# EAGLE design IM920Receiver (EAGLE 9.1.3)
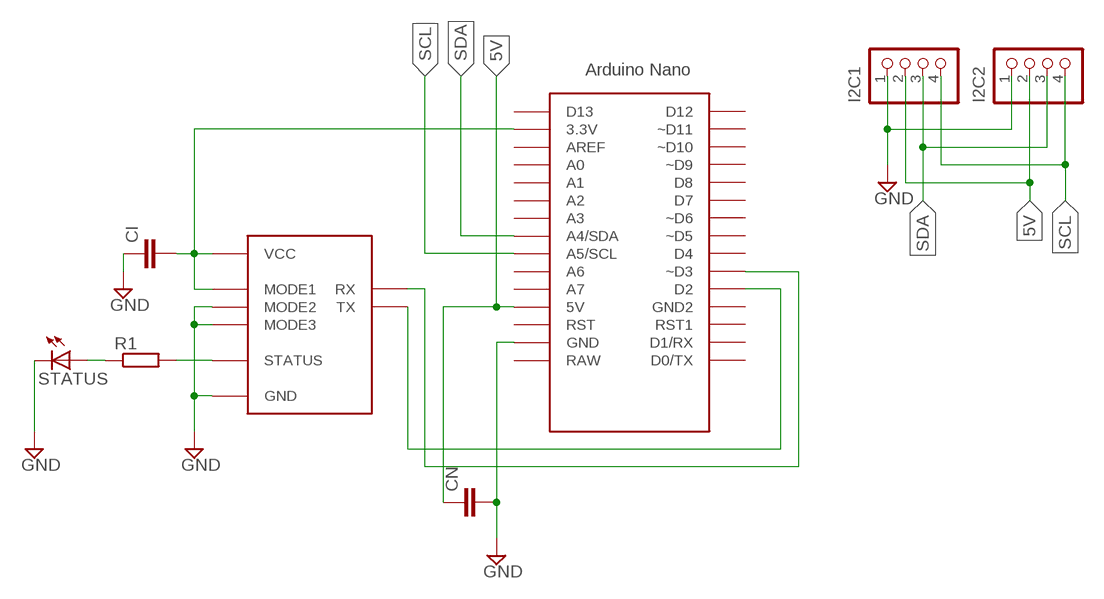
[diagram p0: schematic, sheet 1]

## Parts
CI  C2.5/2  [C2.5-2]
CN  C2.5/2  [C2.5-2]
I2C1  B4B-XH-A  [B4B-XH-A]
I2C2  B4B-XH-A  [B4B-XH-A]
R1  R-EU_0204/7  [0204/7]
STATUS  LED3MM  [LED3MM]
U$1  IM920  [IM920]
U$2  NANO  [NANO]

## Nets
5V: CN.1 I2C1.2 I2C2.2 U$2.5V
GND: CI.1 CN.2 I2C1.1 I2C2.1 STATUS.K(C) U$1.GND U$1.MODE2 U$1.MODE3 U$2.GND
N$1: U$1.TX U$2.D2
N$2: U$1.RX U$2.D3(~D3)
N$3: CI.2 U$1.MODE1 U$1.VCC U$2.3.3V
N$4: R1.2 U$1.STATUS
N$5: R1.1 STATUS.A
SCL: I2C1.4 I2C2.4 U$2.A5(A5/SCL)
SDA: I2C1.3 I2C2.3 U$2.A4(A4/SDA)
Unconnected: U$2.A0 U$2.A1 U$2.A2 U$2.A3 U$2.A6 U$2.A7 U$2.AREF U$2.D4 U$2.D5(~D5) U$2.D6(~D6) U$2.D7 U$2.D8 U$2.D9(~D9) U$2.D10(~D10) U$2.D11(~D11) U$2.D12 U$2.D13 U$2.GND1(GND2) U$2.RAW U$2.RST U$2.RST1 U$2.RX1(D1/RX) U$2.TX0(D0/TX)

## Library data of the parts
CI CN = capacitor-wima:C: CAPACITOR naming: grid - package width
I2C1 I2C2 = jst-xh:B4B-XH-A: Wire-to-Board 2.5mm pitch top mount connector Source: http://www.jst-mfg.com/product/pdf/jpn/XH.pdf http://www.jst-mfg.com/product/detail.php?series=277
R1 = rcl:R-EU_: RESISTOR, European symbol; SPICEPREFIX: R
STATUS = led:LED: LED OSRAM: - CHIPLED LG R971, LG N971, LY N971, LG Q971, LY Q971, LO R971, LY R971 LH N974, LH R974 LS Q976, LO Q976, LY Q976 LO Q996 - Hyper CHIPLED LW Q18S LB Q993, LB Q99A, LB R99A - SideLED LS A670, LO A670, LY A670, LG A670, LP A670 LB A673, LV A673, LT A673, LW A673 LH A674 LY A675 LS A676, LA A676, LO A676, LY A676, LW A676 LS A679, LY A679, LG A679 - Hyper Micro SIDELED® LS Y876, LA Y876, LO Y876, LY Y876 LT Y87S - SmartLED LW L88C, LW L88S LB L89C, LB L89S, LG L890 LS L89K, LO L89K, LY L89K LS L896, LA L896, LO L896, LY L896 - TOPLED LS T670, LO T670, LY T670, LG T670, LP T670 LSG T670, LSP T670, LSY T670, LOP T670, LYG T670 LG T671, LOG T671, LSG T671 LB T673, LV T673, LT T673, LW T673 LH T674 LS T676, LA T676, LO T676, LY T676, LB T676, LH T676, LSB T676, LW T676 LB T67C, LV T67C, LT T67C, LS T67K, LO T67K, LY T67K, LW E67C LS E67B, LA E67B, LO E67B, LY E67B, LB E67C, LV E67C, LT E67C LW T67C LS T679, LY T679, LG T679 LS T770, LO T770, LY T770, LG T770, LP T770 LB T773, LV T773, LT T773, LW T773 LH T774 LS E675, LA E675, LY E675, LS T675 LS T776, LA T776, LO T776, LY T776, LB T776 LHGB T686 LT T68C, LB T68C - Hyper Mini TOPLED® LB M676 - Mini TOPLED Santana® LG M470 LS M47K, LO M47K, LY M47K Source: http://www.osram.convergy.de LUXEON: - LUMILED® LXK2-PW12-R00, LXK2-PW12-S00, LXK2-PW14-U00, LXK2-PW14-V00 LXK2-PM12-R00, LXK2-PM12-S00, LXK2-PM14-U00 LXK2-PE12-Q00, LXK2-PE12-R00, LXK2-PE12-S00, LXK2-PE14-T00, LXK2-PE14-U00 LXK2-PB12-K00, LXK2-PB12-L00, LXK2-PB12-M00, LXK2-PB14-N00, LXK2-PB14-P00, LXK2-PB14-Q00 LXK2-PR12-L00, LXK2-PR12-M00, LXK2-PR14-Q00, LXK2-PR14-R00 LXK2-PD12-Q00, LXK2-PD12-R00, LXK2-PD12-S00 LXK2-PH12-R00, LXK2-PH12-S00 LXK2-PL12-P00, LXK2-PL12-Q00, LXK2-PL12-R00 Source: www.luxeon.com KINGBRIGHT: KA-3528ASYC Source: www.kingbright.com
U$1 = im920:IM920
U$2 = Arduino-clone:NANO: Arduino Nano

## Board
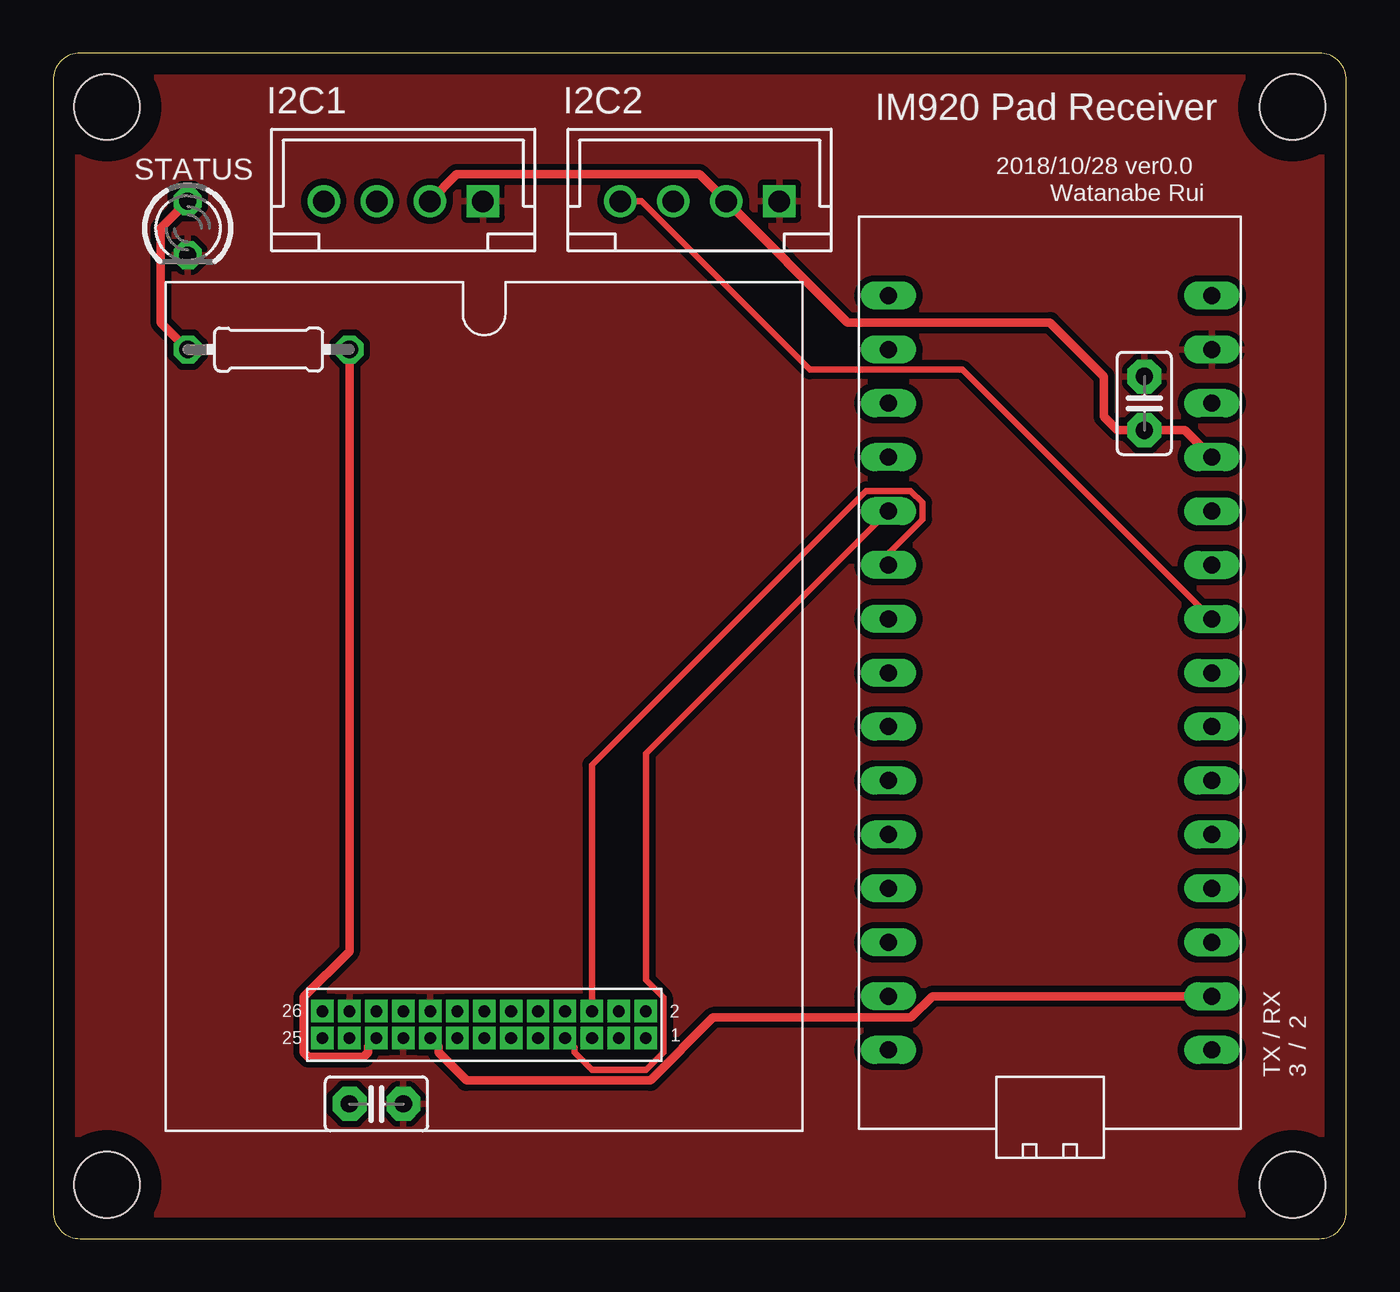
[diagram p1: board, top side]
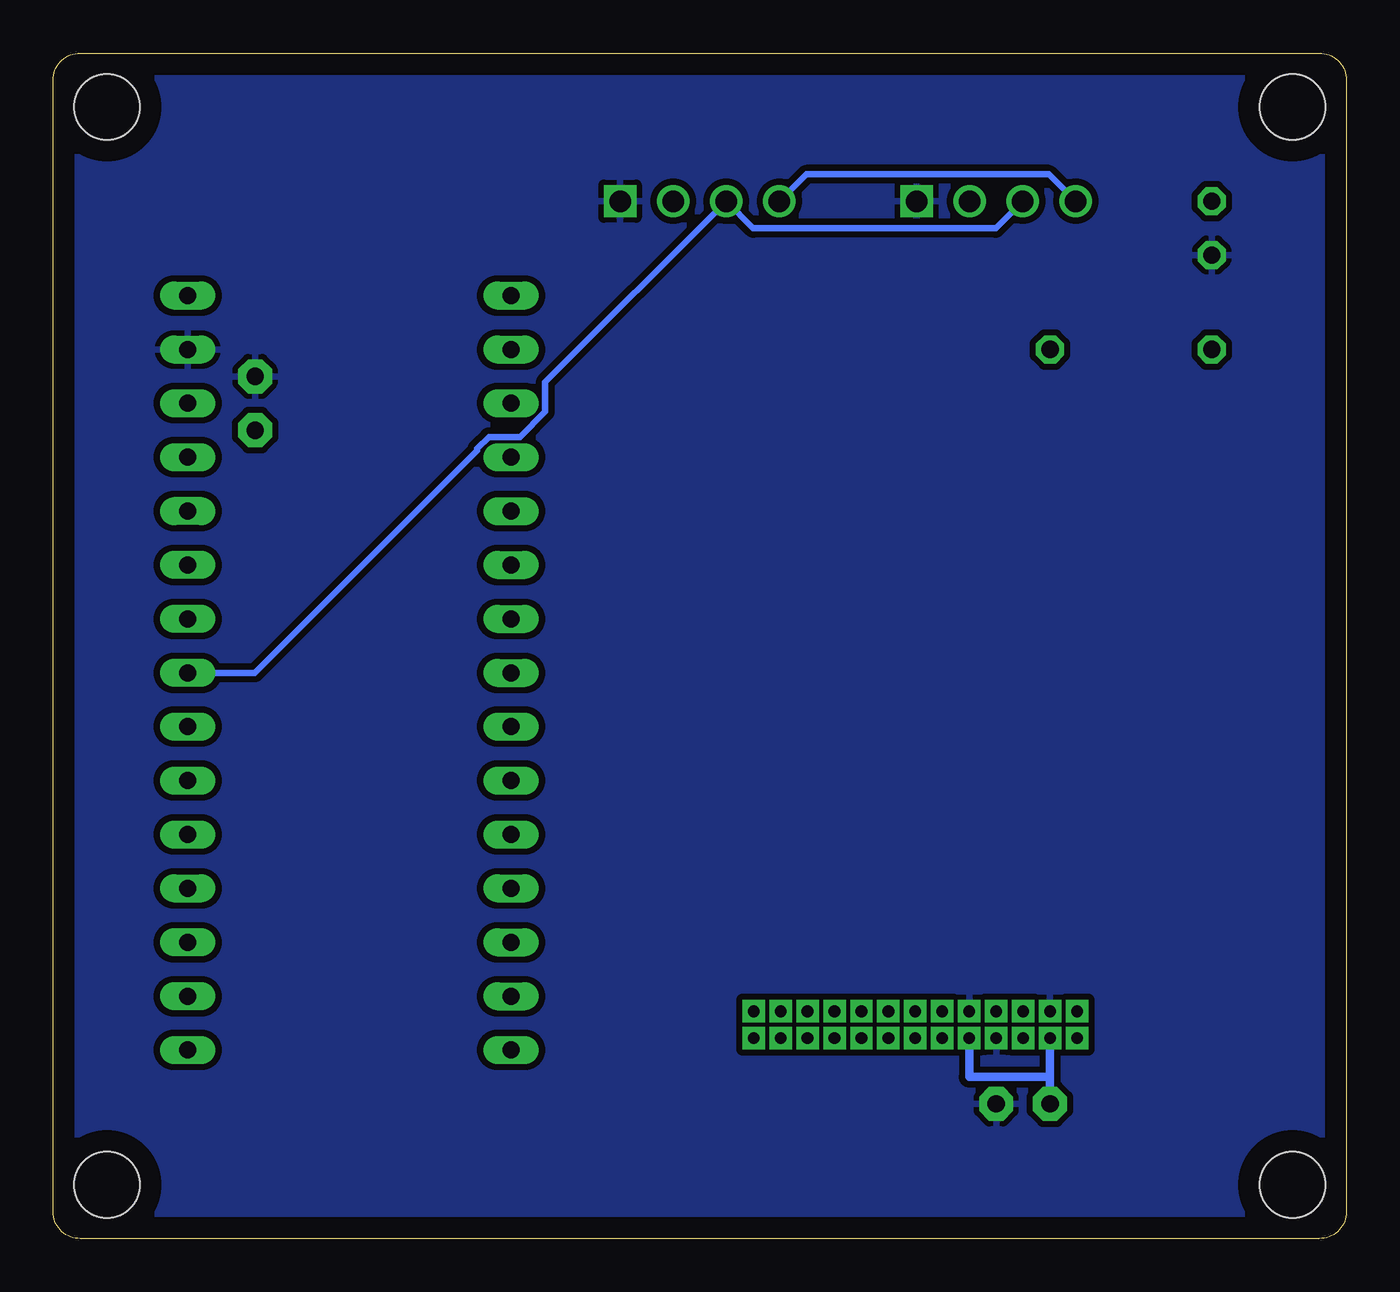
[diagram p2: board, bottom side, seen from below]

Size 60.96 x 55.88 mm. Coordinates in mm from the lower left corner, seen from the top.
Outline: 1.27,0 59.69,0 arc90 60.96,1.27 60.96,54.61 arc90 59.69,55.88 1.27,55.88 arc90 0,54.61 0,1.27 arc90 1.27,0
Copper layers (1*16): Top 0.035mm / dielectric 1.5mm / Bottom 0.035mm
Design rules "default": minimum track width 6mil, minimum drill 0.35mm, track to track 6mil, track to pad 6mil, pad to pad 6mil, via to via 6mil, smd to smd 6mil, copper to edge 40mil, drill to drill 6mil, minimum pad ring 10mil, minimum via ring 8mil, stop-mask expansion 4mil, vias tented up to drill 0mil, thermal gap 10mil
Holes 3.1 mm at 2.54,2.54 58.42,2.54 2.54,53.34 58.42,53.34

### Footprints (pad centres in the part's own frame; a part is rotated, then mirrored left to right if it is on the bottom)
C2.5-2 = drill 0.813 pad 1.6 octagon: 1 -1.27,0; 2 1.27,0
B4B-XH-A = drill 1.016 square: 1 -3.75,0 | drill 1.016: 2 -1.25,0; 3 1.25,0; 4 3.75,0
0204/7 = drill 0.813 octagon: 1 -3.81,0; 2 3.81,0
LED3MM = drill 0.813 octagon: A -1.27,0; K 1.27,0
IM920 = drill 0.55 pad 1 square: GND -6.35,5.635; MODE1 -2.54,4.365; MODE2 -2.54,5.635; MODE3 -3.81,4.365; P$1 7.62,4.365; P$2 7.62,5.635; P$3 6.35,4.365; P$4 6.35,5.635; P$5 5.08,4.365; P$8 3.81,5.635; P$9 2.54,4.365; P$10 2.54,5.635; P$11 1.27,4.365; P$12 1.27,5.635; P$13 0,4.365; P$14 0,5.635; P$15 -1.27,4.365; P$16 -1.27,5.635; P$20 -3.81,5.635; P$22 -5.08,5.635; P$25 -7.62,4.365; P$26 -7.62,5.635; RX 5.08,5.635; STATUS -5.08,4.365; TX 3.81,4.365; VCC -6.35,4.365
NANO = drill 0.8 long: 3.3V -7.62,15.24; 5V -7.62,-10.16; A0 -7.62,10.16; A1 -7.62,7.62; A2 -7.62,5.08; A3 -7.62,2.54; A4 -7.62,0; A5 -7.62,-2.54; A6 -7.62,-5.08; A7 -7.62,-7.62; AREF -7.62,12.7; D2 7.62,-7.62; D3 7.62,-5.08; D4 7.62,-2.54; D5 7.62,0; D6 7.62,2.54; D7 7.62,5.08; D8 7.62,7.62; D9 7.62,10.16; D10 7.62,12.7; D11 7.62,15.24; D12 7.62,17.78; D13 -7.62,17.78; GND -7.62,-15.24; GND1 7.62,-10.16; RAW -7.62,-17.78; RST -7.62,-12.7; RST1 7.62,-12.7; RX1 7.62,-15.24; TX0 7.62,-17.78

### Placement (x,y rotation side)
CI  15.24,6.35 180 top
CN  51.44,39.37 90 top
I2C1  16.51,48.9 180 top
I2C2  30.48,48.9 180 top
R1  10.16,41.91 0 top
STATUS  6.35,47.62 270 top
U$1  20.32,5.08 0 top
U$2  46.99,26.67 180 top

### Tracks (layer width: path | path; a pad name or v marks a point on that pad's centre or on a via)
5V
  Top 0.4: I2C1.2 19.03,50.16 30.46,50.16 I2C2.2 37.45,43.18 46.99,43.18 49.53,40.64 49.53,38.73 50.16,38.1 CN.1 53.34,38.1 U$2.5V
GND
  pour Bottom (isolate 0.3): 0,55.88 0,0 60.96,0 60.96,55.88
  pour Top (isolate 0.3): 60.96,0 60.96,55.88 0,55.88 0,0
N$1
  Top 0.3: U$2.D2 27.94,22.86 27.94,12.2 28.77,11.37 28.77,8.79 27.94,7.96 25.4,7.96 24.57,8.79 24.57,9.01 U$1.TX
N$2
  Top 0.3: U$2.D3 39.37,32.28 40.98,33.89 40.98,34.69 40.42,35.25 38.32,35.25 25.4,22.33 U$1.RX
N$3
  Top 0.4: U$2.3.3V 41.45,11.43 40.44,10.42 31.11,10.42 28.15,7.46 19.48,7.46 18.17,8.77 18.17,9.06 U$1.MODE1
  Bottom 0.4: U$1.VCC 13.97,7.62 | 13.97,7.62 CI.2 | U$1.MODE1 17.78,7.62 13.97,7.62
N$4
  Top 0.4: R1.2 13.97,13.54 11.82,11.39 11.82,8.77 12.03,8.56 14.64,8.56 14.85,8.77 14.85,9.06 U$1.STATUS
N$5
  Top 0.4: STATUS.A 5.08,47.62 5.08,43.18 R1.1
SCL
  Top 0.3: I2C2.4 27.73,48.9 35.67,40.95 42.87,40.95 U$2.A5
  Bottom 0.3: I2C1.4 14.03,50.16 25.46,50.16 I2C2.4
SDA
  Bottom 0.3: I2C1.3 16.53,47.62 27.96,47.62 I2C2.3 37.76,40.37 37.76,38.97 38.95,37.79 40.42,37.79 40.98,37.23 40.98,37.15 51.45,26.67 U$2.A4

### Text on the board
tPlace: IM920 Pad Receiver | 2018/10/28 ver0.0 | Watanabe Rui | TX / RX / 3 / 2